# Altium schematic sheet connector3.SchDoc
size A3; SheetNumber: 6; SheetTotal: 7
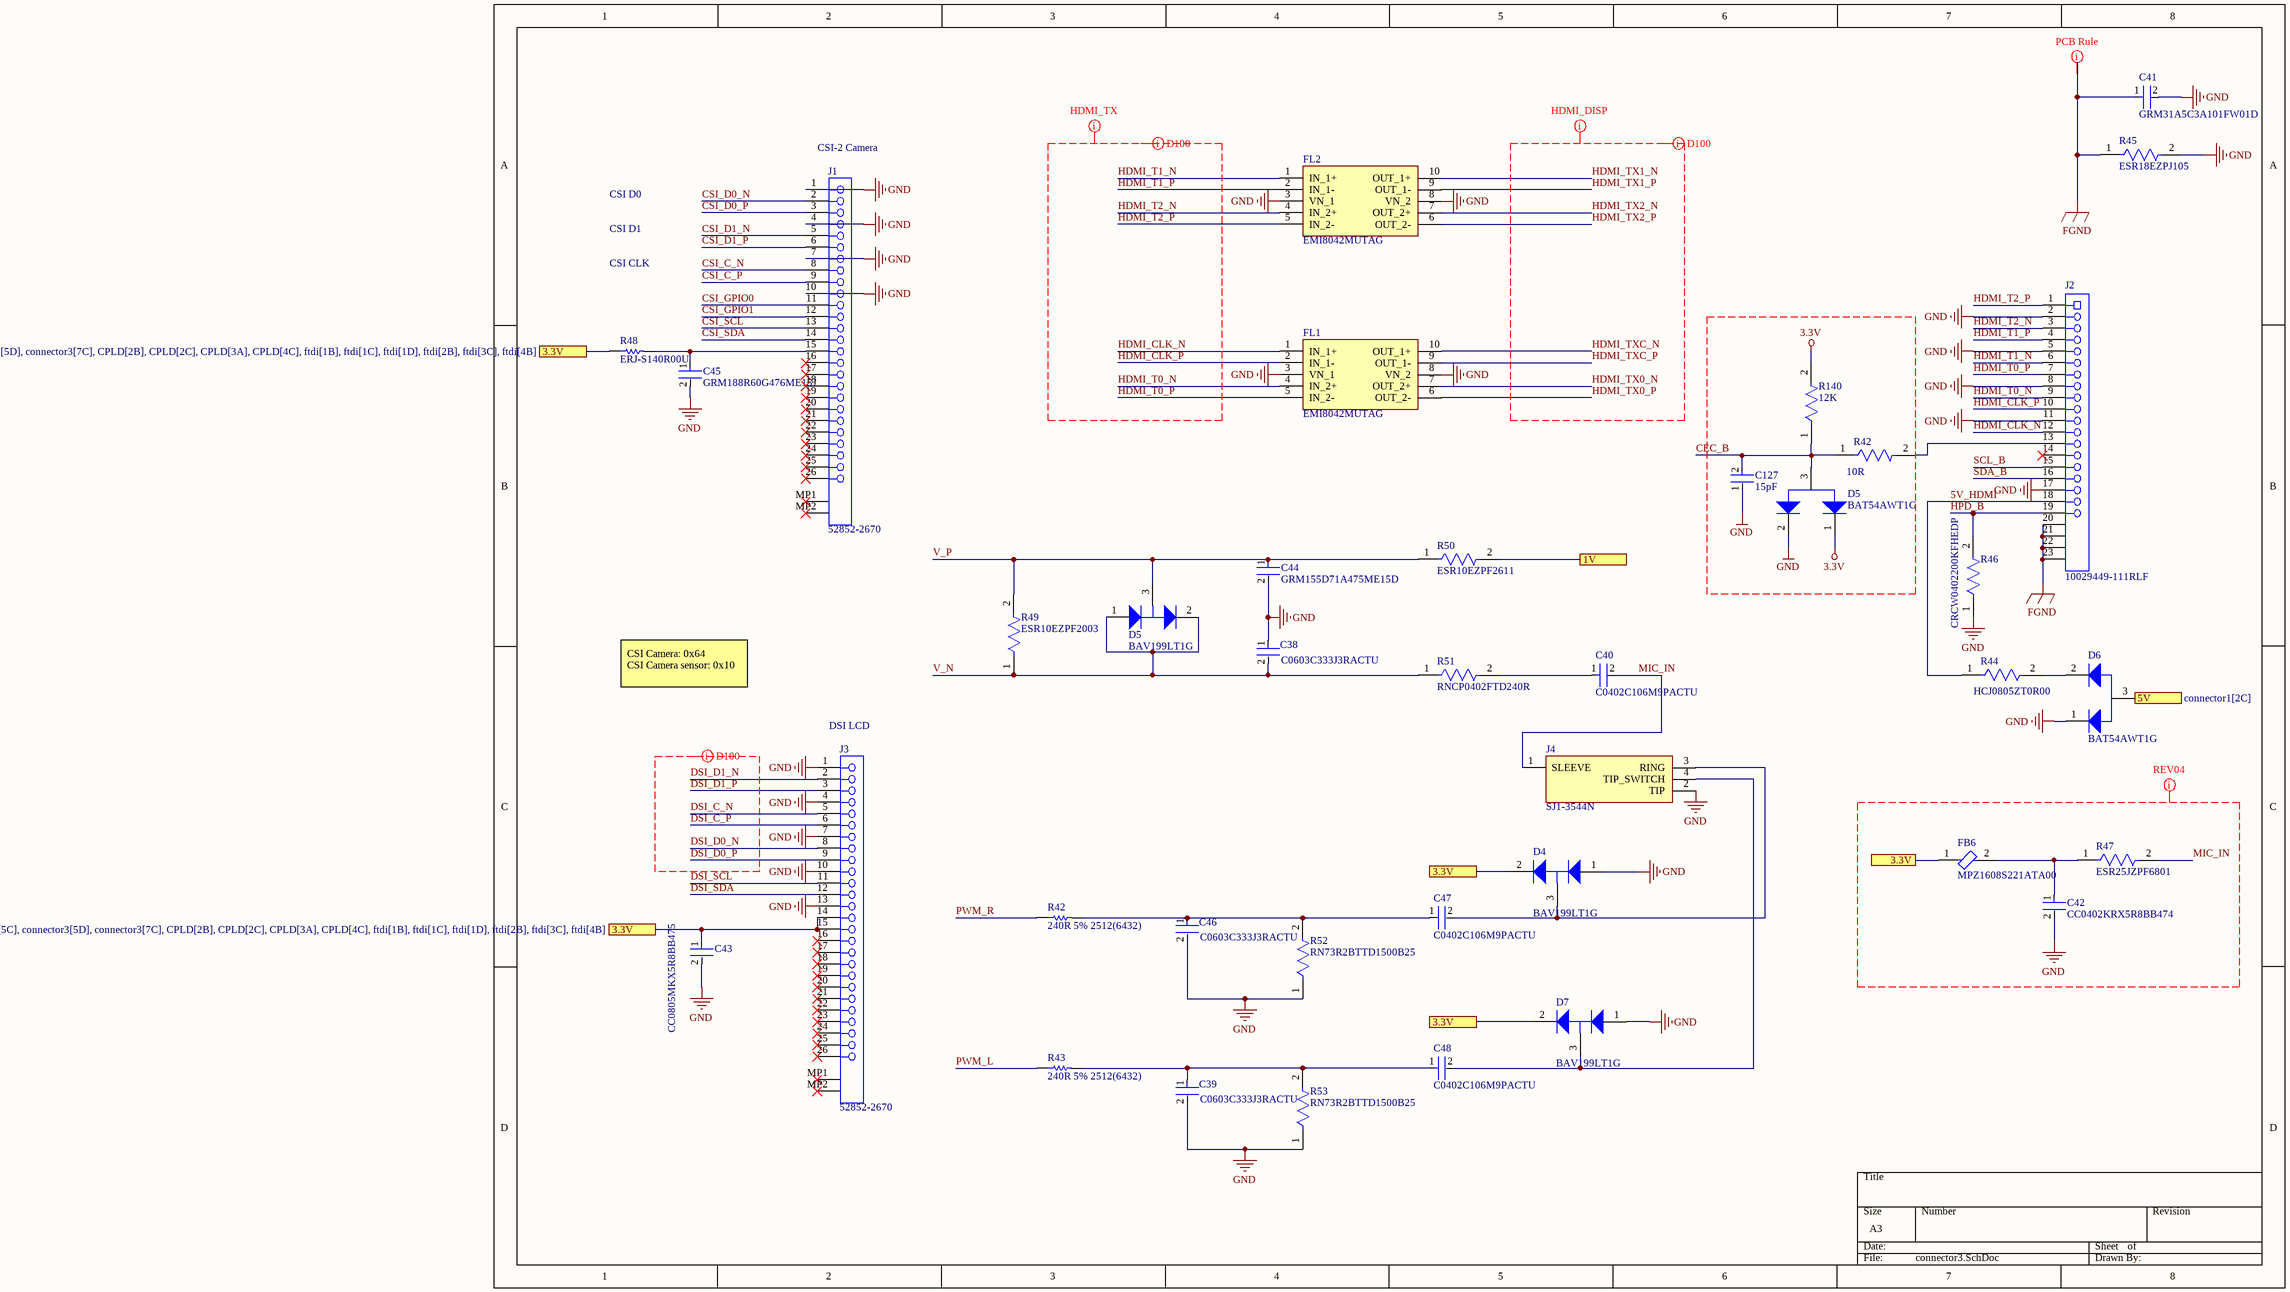
[diagram p0: connector3.SchDoc]

## Parts
(Parts that share a designator on the sheet are numbered #1, #2 ... from top to bottom, then left to right.)
C38  C0603C333J3RACTU  [FP-C0603C-CF-MFG]
C39  C0603C333J3RACTU  [FP-C0603C-CF-MFG]
C40  C0402C106M9PACTU  [FP-C0402C106M9PACTU-MFG]
C41  GRM31A5C3A101FW01D  [FP-GRM31A-0_2-e0_3_0_95-MFG]
C42  CC0402KRX5R8BB474  [FP-CC0402-MFG]
C43  CC0805MKX5R8BB475  [FP-CC0805-0_85-MFG]
C44  GRM155D71A475ME15D  [FP-GRM155-0_2-MFG]
C45  GRM188R60G476ME15J  [FP-GRM188-0_2-IPC_C]
C46  C0603C333J3RACTU  [FP-C0603C-CF-MFG]
C47  C0402C106M9PACTU  [FP-C0402C106M9PACTU-MFG]
C48  C0402C106M9PACTU  [FP-C0402C106M9PACTU-MFG]
C127  15pF  [FP-C1608-080-0_1-IPC_A]
D4  BAV199LT1G  [ONSC-SOT-23-3-318-08_V]
D5#1  BAT54AWT1G  [ONSC-SOT-323-3-419-04_V]
D5#2  BAV199LT1G  [ONSC-SOT-23-3-318-08_V]
D6  BAT54AWT1G  [ONSC-SOT-323-3-419-04_V]
D7  BAV199LT1G  [ONSC-SOT-23-3-318-08_V]
FB6  MPZ1608S221ATA00  [FP-MPZ1608-0_8-MFG]
FL1  EMI8042MUTAG  [EMI8042MUTAG]
FL2  EMI8042MUTAG  [EMI8042MUTAG]
J1  52852-2670  [MOLX-52852-2670]
J2  10029449-111RLF  [FCI-10029449-111RLF_V]
J3  52852-2670  [MOLX-52852-2670]
J4  SJ1-3544N  [SJ13544N]
R42#1  10R  [FP-RT0603-MFG]
R42#2  240R 5% 2512(6432)  [RESC2512(6432)_N]
R43  240R 5% 2512(6432)  [RESC2512(6432)_N]
R44  HCJ0805ZT0R00  [FP-HCJ0805-MFG]
R45  ESR18EZPJ105  [FP-ESR18-IPC_A]
R46  CRCW0402200KFHEDP  [FP-CRCW0402-Pe3-MFG]
R47  ESR25JZPF6801  [FP-ESR25-IPC_A]
R48  ERJ-S140R00U  [RESC3225X70X50LL20T20]
R49  ESR10EZPF2003  [FP-ESR10-IPC_A]
R50  ESR10EZPF2611  [FP-ESR10-MFG]
R51  RNCP0402FTD240R  [FP-RNCP0402-IPC_C]
R52  RN73R2BTTD1500B25  [FP-RN73R2B-IPC_B]
R53  RN73R2BTTD1500B25  [FP-RN73R2B-IPC_B]
R140  12K  [FP-CRGP1210-IPC_A]

## Ports
1V, 3.3V (see connector1[1B], connector1[1D], connector1[2B], connector1[2D], connector2[1B], connector2[3A], connector2[4A], connector2[4C], connector2[4D], connector2[5C], connector2[6B], connector2[6D], connector2[7B], connector3[1B], connector3[1C], connector3[5C], connector3[5D], CPLD[2B], CPLD[2C], CPLD[3A], CPLD[4C], ftdi[1B], ftdi[1C], ftdi[1D], ftdi[2B], ftdi[3C], ftdi[4B]), 3.3V (see connector1[1B], connector1[1D], connector1[2B], connector1[2D], connector2[1B], connector2[3A], connector2[4A], connector2[4C], connector2[4D], connector2[5C], connector2[6B], connector2[6D], connector2[7B], connector3[1B], connector3[1C], connector3[5C], connector3[7C], CPLD[2B], CPLD[2C], CPLD[3A], CPLD[4C], ftdi[1B], ftdi[1C], ftdi[1D], ftdi[2B], ftdi[3C], ftdi[4B]), 3.3V (see connector1[1B], connector1[1D], connector1[2B], connector1[2D], connector2[1B], connector2[3A], connector2[4A], connector2[4C], connector2[4D], connector2[5C], connector2[6B], connector2[6D], connector2[7B], connector3[1B], connector3[1C], connector3[5D], connector3[7C], CPLD[2B], CPLD[2C], CPLD[3A], CPLD[4C], ftdi[1B], ftdi[1C], ftdi[1D], ftdi[2B], ftdi[3C], ftdi[4B]), 3.3V (see connector1[1B], connector1[1D], connector1[2B], connector1[2D], connector2[1B], connector2[3A], connector2[4A], connector2[4C], connector2[4D], connector2[5C], connector2[6B], connector2[6D], connector2[7B], connector3[1B], connector3[5C], connector3[5D], connector3[7C], CPLD[2B], CPLD[2C], CPLD[3A], CPLD[4C], ftdi[1B], ftdi[1C], ftdi[1D], ftdi[2B], ftdi[3C], ftdi[4B]), 3.3V (see connector1[1B], connector1[1D], connector1[2B], connector1[2D], connector2[1B], connector2[3A], connector2[4A], connector2[4C], connector2[4D], connector2[5C], connector2[6B], connector2[6D], connector2[7B], connector3[1C], connector3[5C], connector3[5D], connector3[7C], CPLD[2B], CPLD[2C], CPLD[3A], CPLD[4C], ftdi[1B], ftdi[1C], ftdi[1D], ftdi[2B], ftdi[3C], ftdi[4B]), 5V (see connector1[2C])

## Nets
3.3V: D5#1.1(K1) R140.2
FGND: C41.1 J2.20(SHLD1) J2.21(SHLD2) J2.22(SHLD3) J2.23(SHLD4) R45.1
GND: C38.1 C39.2 C41.2 C42.2 C43.2 C44.2 C45.2 C46.2 C127.1 D4.1(A) D5#1.2(K2) D6.1(K1) D7.1(A) FL1.3(VN_1) FL1.8(VN_2) FL2.3(VN_1) FL2.8(VN_2) J1.1 J1.4 J1.7 J1.10 J2.2 J2.5 J2.8 J2.11 J2.17 J3.1 J3.4 J3.7 J3.10 J3.13 J4.2(TIP) R45.2 R46.1 R52.1 R53.1
1V: R50.2 ; port 1V
3.3V: C43.1 D4.2(K) D7.2(K) FB6.1 J3.14 J3.15 R48.1 ; port 3.3V  [a separate net that carries the same name]
5V: D6.3(A) ; port 5V
5V_HDMI: J2.18 R44.1
CEC_B: C127.2 D5#1.3(A) R42#1.1 R140.1
CSI_C_N: J1.8
CSI_C_P: J1.9
CSI_D0_N: J1.2
CSI_D0_P: J1.3
CSI_D1_N: J1.5
CSI_D1_P: J1.6
CSI_GPIO0: J1.11
CSI_GPIO1: J1.12
CSI_SCL: J1.13
CSI_SDA: J1.14
DSI_C_N: J3.5
DSI_C_P: J3.6
DSI_D0_N: J3.8
DSI_D0_P: J3.9
DSI_D1_N: J3.2
DSI_D1_P: J3.3
DSI_SCL: J3.11
DSI_SDA: J3.12
HDMI_CLK_N: FL1.1(IN_1+) J2.12
HDMI_CLK_P: FL1.2(IN_1-) J2.10
HDMI_T0_N: FL1.4(IN_2+) J2.9
HDMI_T0_P: FL1.5(IN_2-) J2.7
HDMI_T1_N: FL2.1(IN_1+) J2.6
HDMI_T1_P: FL2.2(IN_1-) J2.4
HDMI_T2_N: FL2.4(IN_2+) J2.3
HDMI_T2_P: FL2.5(IN_2-) J2.1
HDMI_TX0_N: FL1.7(OUT_2+)
HDMI_TX0_P: FL1.6(OUT_2-)
HDMI_TX1_N: FL2.10(OUT_1+)
HDMI_TX1_P: FL2.9(OUT_1-)
HDMI_TX2_N: FL2.7(OUT_2+)
HDMI_TX2_P: FL2.6(OUT_2-)
HDMI_TXC_N: FL1.10(OUT_1+)
HDMI_TXC_P: FL1.9(OUT_1-)
HPD_B: J2.19 R46.2
MIC_IN: C40.2 J4.1(SLEEVE) R47.2
PWM_L: R43.1
PWM_R: R42#2.1
SCL_B: J2.15
SDA_B: J2.16
V_N: C38.2 D5#2.1(A) D5#2.2(K) R49.1 R51.1
V_P: C44.1 D5#2.3(K/A) R49.2 R50.1
NetC39_1: C39.1 C48.1 R43.2 R53.2
NetC40_1: C40.1 R51.2
NetC42_1: C42.1 FB6.2 R47.1
NetC45_1: C45.1 J1.15 R48.2
NetC46_1: C46.1 C47.1 R42#2.2 R52.2
NetC47_2: C47.2 D4.3(K/A) J4.3(RING)
NetC48_2: C48.2 D7.3(K/A) J4.4(TIP_SWITCH)
NetD6_2: D6.2(K2) R44.2
NetJ2_13: J2.13 R42#1.2

Not connected (* = marked no-connect by the designer): J1 16* 17* 18* 19* 20* 21* 22* 23* 24* 25* 26* MP1* MP2*; J2 14*; J3 16* 17* 18* 19* 20* 21* 22* 23* 24* 25* 26* MP1* MP2*

## Layout directives
mark named REV04: GND, MIC_IN
differential pair: DSI_C_N, DSI_C_P, DSI_D0_N, DSI_D0_P, DSI_D1_N, DSI_D1_P, HDMI_CLK_N, HDMI_CLK_P, HDMI_T0_N, HDMI_T0_P, HDMI_T1_N, HDMI_T1_P, HDMI_T2_N, HDMI_T2_P, HDMI_TX0_N, HDMI_TX0_P, HDMI_TX1_N, HDMI_TX1_P, HDMI_TX2_N, HDMI_TX2_P, HDMI_TXC_N, HDMI_TXC_P
mark named HDMI_TX: HDMI_CLK_N, HDMI_CLK_P, HDMI_T0_N, HDMI_T0_P, HDMI_T1_N, HDMI_T1_P, HDMI_T2_N, HDMI_T2_P
mark named HDMI_DISP: HDMI_TX0_N, HDMI_TX0_P, HDMI_TX1_N, HDMI_TX1_P, HDMI_TX2_N, HDMI_TX2_P, HDMI_TXC_N, HDMI_TXC_P

## Notes on the sheet
- (near J1) CSI-2 Camera
- CSI D0
- CSI D1
- CSI CLK
- CSI Camera: 0x64
  CSI Camera sensor: 0x10
- (near J3) DSI LCD

## Library data of the parts
C38 C39 C46 = CMP-2006-03180-2: CAP CER 0.033UF 25V 5% X7R 0603; Manufacturer: KEMET; Tolerance: 0.05; Automotive Grade: Grade 1; Value: 33,000 pF; Material: Ceramic; Temperature Coefficient: 30ppm/°C; Manufacturer Part Number: C0603C333J3RACTU; Device Class L1: Passive Components; Temperature Characteristic: X7R; Temperature Range High: +125°C; Device Class L3: Ceramic Capacitors; ComponentLink2URL: https://api.kemet.com/component-edge/download/datasheet/C0603C100J5GACAUTO.pdf; RoHS: TRUE; Package: C0603C-CF; Voltage Rating: 25 V; Lead Free: Yes; ComponentLink2Description: Datasheet; Mouser Description: Multilayer Ceramic Capacitors MLCC - SMD/SMT 25volts 33000pF X7R 5%; Device Class L2: Capacitors; Height: 0.87mm; Octopart: https://octopart.com/c0603c333j3ractu-kemet-9143319; Temperature Range Low: -55°C; Temperature: -55°C to +125°C; Capacitance: 33,000 pF; Digikey Description: CAP CER 0.033UF 25V 5% X7R 0603; Automotive: Yes; Category: Cap
C40 C47 C48 = CMP-03020-034678-1: CAP CER 10UF 6.3V X5R 0402; Tolerance: 20%; Dielectric Material: Ceramic; Voltage Rating: 6.3V; Thickness: 0.028inch; REACH SVHC: No SVHC; RoHS Compliant: Yes; Case Code (Metric): 1005; Lead Free: Lead Free; Length: 0.039inch; Max Operating Temperature: 85°C; Capacitance: 10uF; Voltage Rating (DC): 6.3V; Min Operating Temperature: -55°C; Case/Package: 0402; Mount: Surface Mount; Case Code (Imperial): 0402; Dielectric: X5R; Packaging: Cut Tape; Width: 0.02inch
C41 = CMP-06035-018314-1: Chip Multilayer Ceramic Capacitors for General Purpose, 1206, 100pF, C0G, 30ppm/°C, 1%, 1kV
C42 = CMP-03422-001152-1: CC0402 470 nF X5R 10.00% 25 V; Manufacturer: YAGEO; Value: 470 nF; Tolerance: 0.1; Temperature Coefficient: 30ppm/°C; Voltage Rating: 25 V; Automotive Grade: NA; Material: Ceramic; Temperature Characteristic: X5R; Category: Cap; Ipc Land Pattern Name: CAPC10050X50; Height: 0.55mm; Device Class L3: Ceramic Capacitors; Device Class L1: Passive Components; Temperature: -55°C to +125°C; ComponentLink2URL: http://www.yageo.com/documents/recent/UPY-GP_NP0_16V-to-50V_16.pdf; Device Class L2: Capacitors; Package: CC0402; Footprint Url: http://www.yageo.com/exep/pages/download/literatures/UPY-C_GEN_24.pdf; Lead Free: Yes; Temperature Range Low: -55°C; Octopart: https://octopart.com/cc0402krx5r8bb474-yageo-77039652; Mouser Description: Cap Ceramic 0.47uF 25VDC X5R 10% SMD 0402 85°C Paper T/R; ComponentLink2Description: Datasheet; Capacitance: 470 nF; RoHS: TRUE; Temperature Range High: +125°C; Automotive: No; Manufacturer Part Number: CC0402KRX5R8BB474
C43 = CMP-03422-000024-1: CAP CER 4.7UF 25V X5R 0805; Manufacturer: Yageo; Tolerance: 0.2; Material: Ceramic; Temperature Range Low: -30°C; Manufacturer Part Number: CC0805MKX5R8BB475; Automotive: No; Device Class L1: Passive Components; ComponentLink2Description: Datasheet; Mouser Description: Multilayer Ceramic Capacitors MLCC - SMD/SMT 4.7M pF 25 Volts 20%; Voltage Rating: 25 V; Category: Cap; Lead Free: Yes; Ipc Land Pattern Name: CAPC200125X85; Capacitance: 4.7 uF; Device Class L2: Capacitors; RoHS: TRUE; Temperature Characteristic: X5R; Temperature Range High: +85°C; Digikey Description: CAP CER 4.7UF 25V X5R 0805; Package: CC0805-0.85; ComponentLink2URL: http://www.yageo.com/documents/recent/UPY-GPHC_Y5V_6.3V-to-50V_8.pdf; Height: 0.95mm; Device Class L3: Ceramic Capacitors; Temperature: -30°C to +85°C; Octopart: https://octopart.com/cc0805mkx5r8bb475-yageo-51849249; Footprint Url: http://www.yageo.com/exep/pages/download/literatures/UPY-C_GEN_24.pdf; Value: 4.7 uF
C44 = CMP-00260-57366380-1: GRM155D71A475ME15D Cap Ceramic Monolithic 4.7uF 10VDC 20% SMD Paper T/R; Capacitance: 4.7µF; Dielectric: X7T; Voltage Rating (DC): 10V; Length: 1mm; Thickness: 500µm; NexarPartId: 57366380; Width: 500µm; Case/Package: 0402; Lifecycle Status: Production
C45 = CMP-06035-022085-1: Chip Multilayer Ceramic Capacitors for General Purpose, 0603, 47uF, X5R, 15%, 20%, 4V
C127 = CMP-08246-005717-1: Multilayer Ceramic Capacitors 15pF ±5% 50V NP0 SMD 0603; Dielectric: C0G; Case Code (Metric): 1608; Mount: Surface Mount; Weight: 7.1E-05oz; Case/Package: 0603; Voltage Rating: 50V; Length: 0.063inch; Termination: SMD/SMT; Max Operating Temperature: 150°C; Tolerance: 5%; Width: 0.031inch; Packaging: Tape and Reel; Min Operating Temperature: -55°C; Series: C; Capacitance: 15pF; Voltage Rating (DC): 50V; Package Quantity: 4000; Height: 0.8mm; RoHS Compliant: Yes; Case Code (Imperial): 0603; Features: High Temperature; Thickness: 0.035inch
D4 D5#2 D7 = CMP-1054-00087-1: Dual Series Switching Diodes, 3-Pin SOT-23, Pb-Free, Tape and Reel; Manufacturer: On Semiconductor; IF Max (A): 0.215; trr Max (ns): 3000; PartNumber: BAV199LT1G; RoHS: TRUE; ComponentLink1Description: Manufacturer URL; ComponentLink2URL: http://www.onsemi.com/pub_link/Collateral/BAV199LT1-D.PDF; Mounting Technology: Surface Mount; ComponentLink2Description: Datasheet; ComponentLink3Description: Package Specification; PackageReference: SOT-23-3-318-08; PackageVersion: Rev. AP, 11/2009; Packing: Tape and Reel; DatasheetVersion: Rev. 8; Configuration: Dual Series; ComponentLink1URL: http://www.onsemi.com/; ComponentLink3URL: http://www.onsemi.cn/pub_link/Collateral/318-08.PDF; PackageDescription: 3-Pin Small Outline Transistor, Body 2.92 x 1.3 mm, Pitch 0.95 mm
D5#1 D6 = CMP-1055-00555-1: Schottky Barrier Diodes, 3-Pin SOT-323, Pb-Free, Tape and Reel; Manufacturer: On Semiconductor; trr Max (ns): 5; IFSM Max (A): 0.6; Configuration: Common Anode; ComponentLink3URL: http://www.onsemi.com/pub_link/Collateral/419-04.PDF; ComponentLink2Description: Datasheet; ComponentLink2URL: http://www.onsemi.cn/pub_link/Collateral/BAT54AWT1-D.PDF; DatasheetVersion: Rev. 3; PackageVersion: Rev. N, 11/2008; ComponentLink3Description: Package Specification; ComponentLink1Description: Manufacturer URL; ComponentLink1URL: http://www.onsemi.com/; PartNumber: BAT54AWT1G; Packing: Tape and Reel; Mounting Technology: Surface Mount; PackageDescription: 3-Pin Small Outline Transistor, Body 2 x 1.25 mm, Pitch 0.65 mm; RoHS: TRUE; PackageReference: SOT-323-3-419-04
FB6 = CMP-08257-000028-1: Power line Ferrite Bead 220Ω @ 100MHz 2.2A DCR 0.05Ω SMD 0603; DC Resistance (DCR): 50mR; Tolerance: 25%; Impedance: 220R; Series: MPZ; Width: 0.031inch; REACH SVHC: No SVHC; Case Code (Imperial): 0603; Current Rating: 2.2A; Case/Package: 0603; Packaging: Cut Tape; Height: 0.037inch; Number of Pins: 2; Max DC Current: 2.2A; Lead Free: Lead Free; RoHS Compliant: Yes; Mount: Surface Mount; Case Code (Metric): 1608; Length: 0.063inch; Package Quantity: 1; Core Material: Ferrite
FL1 FL2 = EMI8042MUTAG: Filter; Manufacturer_Name: onsemi; Datasheet Link: https://www.onsemi.com/pub/Collateral/EMI8041-D.PDF; Height: 0.5mm; Manufacturer_Part_Number: EMI8042MUTAG; Mouser Part Number: 863-EMI8042MUTAG; Mouser Price/Stock: https://www.mouser.co.uk/ProductDetail/onsemi/EMI8042MUTAG?qs=tCMd4XlZ%2FiBFlejw6GBNJQ%3D%3D; Arrow Part Number: EMI8042MUTAG; Arrow Price/Stock: https://www.arrow.com/en/products/emi8042mutag/on-semiconductor?utm_currency=USD&region=nac
J1 J3 = CMP-1241-00458-1: 1.0 mm Pitch Easy-On(TM) Type FFC Connector, 3.1 mm Mated Height, Right Angle, Non-ZIF, SMT, Bottom Contact, 26 Circuits, -20 to 80 degC, ELV and RoHS Compliant, Tape and Reel; Manufacturer: Molex; Entry Angle: 90degrees Angle; Material - Plating Termination: Tin-Bismuth; Mated Height: 3.10mm; Circuits (maximum): 26; PCB Locator: No; Pitch - Mating Interface: 1.00mm; Current (Max per Contact): 0.5A; Voltage (Max): 50V AC (RMS)/DC; PCB Retention: Yes; Material - Metal: Phosphor Bronze; Durability (mating cycles max): 10; ComponentLink3Description: Package Specification; Material - Plating Mating: Tin-Bismuth; Orientation: Right Angle; ComponentLink2Description: Datasheet; Mounting Technology: Surface Mount; Packing: Tape and Reel; PackageDescription: 26-Lead FFC Connector, Pitch 1.0 mm; PackageVersion: Rev. A, 11/2004; PackageReference: 52852-2670; PartNumber: 52852-2670; Number of Rows: 1; Stackable: No; Polarized to PCB: No; Contact Position: Bottom; Pitch - Termination Interface: 1.00mm; ComponentLink2URL: http://www.molex.com/webdocs/datasheets/pdf/en-us/0528522670_FFC_FPC_CONNECTORS.pdf; ComponentLink1Description: Manufacturer URL; RoHS: TRUE; Circuits (Loaded): 26; ComponentLink1URL: http://www.molex.com/molex/index.jsp; ComponentLink3URL: http://www.molex.com/pdm_docs/sd/528522670_sd.pdf
J2 = CMP-2000-05117-1: Surface Mount Type A HDMI Receptacle without Flange, 19 Positions, 0.5 mm Pitch, -55 to 85 degC, RoHS, Tape and Reel; Manufacturer: FCI; Gender: Female; Number of Positions / Contacts: 19; Contact Rating: 0.5A; Voltage Rating: 40V; Insulation Resistance: 100MOhms; RoHS: Details; Datasheet URL: https://datasheet.ciiva.com/851/10029449-851120.pdf; Termination Style: SMD; Contact Plating: Gold; Housing Material: Resin; Product Type: HDMI; Color: Black; Number of Positions: 19; Mounting Style: SMD/SMT; Packaging: Reel; Brand: FCI; Manufacturer URL: http://www.fci.com/; Contact Material: CopperAlloy; Orientation: Horizontal; Factory Pack Quantity: 400; Operating Temperature Range: -55Cto+85C; Product Category: HDMI,Displayport&DVIConnectors; Datasheet Version: Rev. S, 06/2012
J4 = SJ1-3544N: Connector; Manufacturer_Name: Same Sky; Datasheet Link: https://www.cuidevices.com/product/discontinued/sj1-354xn-series.pdf; Height: 11.2mm; Manufacturer_Part_Number: SJ1-3544N; Mouser Part Number: 490-SJ1-3544N; Mouser Price/Stock: https://www.mouser.co.uk/ProductDetail/CUI-Devices/SJ1-3544N?qs=WyjlAZoYn526mg3g4cTy9w%3D%3D
R42#1 = CMP-03412-033408-1: RES SMD 10 OHM 1% 1/10W 0603; Manufacturer Part Number: RT0603FRE0710RL; Manufacturer: Yageo; Voltage Rating: 75V; Power Rating: 0.1W; Temperature Coefficient: 50 ppm/°C; Resistance: 10Ω; Description: RT0603 10Ω 0.1W 50 ppm/°C 1.00%; Tolerance: 0.01; Value: 10Ω; Footprint Url: http://www.yageo.com/exep/pages/download/literatures/PYu-R_Mount_10.pdf; Ipc Land Pattern Name: RESC16080X45; RoHS: TRUE; Device Class L2: Resistors; Device Class L3: Chip SMD Resistors; Category: Res; Device Class L1: Passive Components; ComponentLink2URL: http://www.yageo.com/documents/recent/PYu-RT_1-to-0.01_RoHS_L_9.pdf; Temperature Range Low: -55°C; Height: 0.55mm; Digikey Description: RES SMD 10 OHM 1% 1/10W 0603; Temperature Range High: +155°C; Lead Free: Yes; Composition: Thin Film; Mouser Description: Thin Film Resistors - SMD 1/10W 10 ohm 1% 50ppm; Automotive: No; Package: RT0603; Temperature: -55°C to +155°C; Series: RT; ComponentLink2Description: Datasheet; Octopart: https://octopart.com/rt0603fre0710rl-yageo-39827693
R42#2 R43 = CMP-1018-00059-1: 240R 1W 5% 2512 (6432 Metric)  SMD; Value: 240.00 Ohm; Case-EIA: 2512; Case-Metric: 6432; Technology: SMT; Power: 1 W; Tolerance: 5 %
R44 = CMP-26527-000104-1: RES 0 OHM JUMPER 1/2W 0805; Resistance: 0mR; Radiation Hardening: No; Case Code (Imperial): 0805; Number of Terminations: 2; Lead Free: Lead Free; Max Operating Temperature: 155°C; Width: 0.049inch; Case Code (Metric): 2012; Height: 0.026inch; Mount: Surface Mount; Min Operating Temperature: -55°C; Packaging: Tape and Reel; Package Quantity: 1; Termination: Wraparound; Length: 0.079inch; RoHS Compliant: Yes; Case/Package: 0805
R45 = CMP-08839-028439-1: 1MΩ ±5% 0.5W 1206 Anti-Surge Chip Resistor AEC-Q200; Temperature Coefficient: 200ppm/°C; Resistance: 1MR; Max Power Dissipation: 333mW; Min Operating Temperature: -55°C; Width: 0.063inch; Features: Automotive AEC-Q200; RoHS Compliant: Yes; Packaging: Tape and Reel; Number of Terminations: 2; Height: 0.026inch; Tolerance: 5%; Series: ESR18; Package Quantity: 5000; Case/Package: 1206; Case Code (Imperial): 1206; Max Operating Temperature: 155°C; Length: 0.126inch; Resistor Type: Thick Film; Case Code (Metric): 3216
R46 = CMP-03613-000144-1: RES Thick Film, 200kΩ, 1%, 0.063W, 50ppm/°C, 0402; Resistance: 200kR; Max Power Dissipation: 63mW; Resistor Type: Thick Film; Package Quantity: 10000; Width: 0.02inch; Packaging: Tape and Reel; Min Operating Temperature: -55°C; Series: CRCW-P; Case/Package: 0402; Number of Terminations: 2; Max Operating Temperature: 155°C; Features: Automotive AEC-Q200; Temperature Coefficient: 50ppm/°C; Height: 0.016inch; Tolerance: 1%; RoHS Compliant: Yes; Length: 0.039inch
R47 = CMP-08839-028349-1: 6.8kΩ ±1% 0.66W 1210 Anti-Surge Chip Resistor AEC-Q200; Resistance: 6.8kR; Temperature Coefficient: 100ppm/°C; Max Power Dissipation: 500mW; Case/Package: 1210; RoHS Compliant: Yes; Packaging: Tape and Reel; Series: ESR25; Height: 0.026inch; Number of Terminations: 2; Width: 0.098inch; Max Operating Temperature: 155°C; Tolerance: 1%; Package Quantity: 4000; Length: 0.126inch; Min Operating Temperature: -55°C; Resistor Type: Thick Film
R48 = CMP-2005-03785-1: Manufacturer: Panasonic; Part Number: ERJ-S140R00U
R49 = CMP-08839-028520-1: 200kΩ ±1% 0.4W 0805 Anti-Surge Chip Resistor AEC-Q200; Temperature Coefficient: 100ppm/°C; Resistance: 200kR; Max Power Dissipation: 400mW; Series: ESR10; Case/Package: 0805; Package Quantity: 5000; Features: Automotive AEC-Q200; Number of Terminations: 2; Max Operating Temperature: 155°C; Height: 0.026inch; Width: 0.049inch; Packaging: Tape and Reel; Resistor Type: Thick Film; Min Operating Temperature: -55°C; Length: 0.079inch; Tolerance: 1%; RoHS Compliant: Yes
R50 = CMP-08839-005625-1: 2.61kΩ ±1% 0.4W 0805 Anti-Surge Chip Resistor AEC-Q200; Max Power Dissipation: 400mW; Resistance: 2.61kR; Temperature Coefficient: 100ppm/°C; Features: Automotive AEC-Q200; Power Rating: 400mW; Lead Free: Lead Free; RoHS Compliant: Yes; Max Operating Temperature: 155°C; Packaging: Tape and Reel; Number of Terminations: 2; Tolerance: 1%; Case/Package: 0805; Min Operating Temperature: -55°C; Series: ESR
R51 = CMP-26527-003352-1: 240Ω ±1% 0.1W 0402 High Power Anti-Sulfur Thin Film Chip Resistor; Resistance: 240R; Temperature Coefficient: 100ppm/°C; Mount: Surface Mount; Contact Plating: Tin; Tolerance: 1%; Max Operating Temperature: 155°C; RoHS Compliant: Yes; Packaging: Tape and Reel; Min Operating Temperature: -55°C; Resistor Type: Thin Film; Radiation Hardening: No; Case/Package: 0402
R52 R53 = CMP-04015-051805-1: 150Ω ±0.1% 0.25W, 1/4W Chip Resistor 1206 (3216 Metric) Moisture Resistant Thin Film
R140 = CMP-03211-001315-1: CRGP1210 12KΩ 0.75W ±100ppm/°C 1% 200V; Manufacturer Part Number: CRGP1210F12K; Manufacturer: TE; Tolerance: 0.01; ComponentLink2Description: Datasheet; Value: 12KΩ; Power Rating: 0.75W; Series: CRGP; Voltage Rating: 200V; Lead Free: Yes; Ipc Land Pattern Name: RESC310260X55; Temperature Coefficient: ±100ppm/°C; Category: Res; Device Class L3: Chip SMD Resistors; Temperature: -55°C to +155°C; Octopart: https://octopart.com/crgp1210f12k-te+connectivity-91018908; Height: 0.65mm; Composition: Thick Film; ComponentLink2URL: https://www.te.com/commerce/DocumentDelivery/DDEController?Action=srchrtrv&DocNm=9-1773463-9&DocType=Data+Sheet&DocLang=English&DocFormat=pdf&PartCntxt=4-2176329-938; Package: CRGP1210; Device Class L2: Resistors; RoHS: TRUE; Automotive: No; Temperature Range Low: -55°C; Device Class L1: Passive Components; Resistance: 12KΩ; Temperature Range High: +155°C